# Altium project Mjollnir.PrjPcb (part 2 of 2)
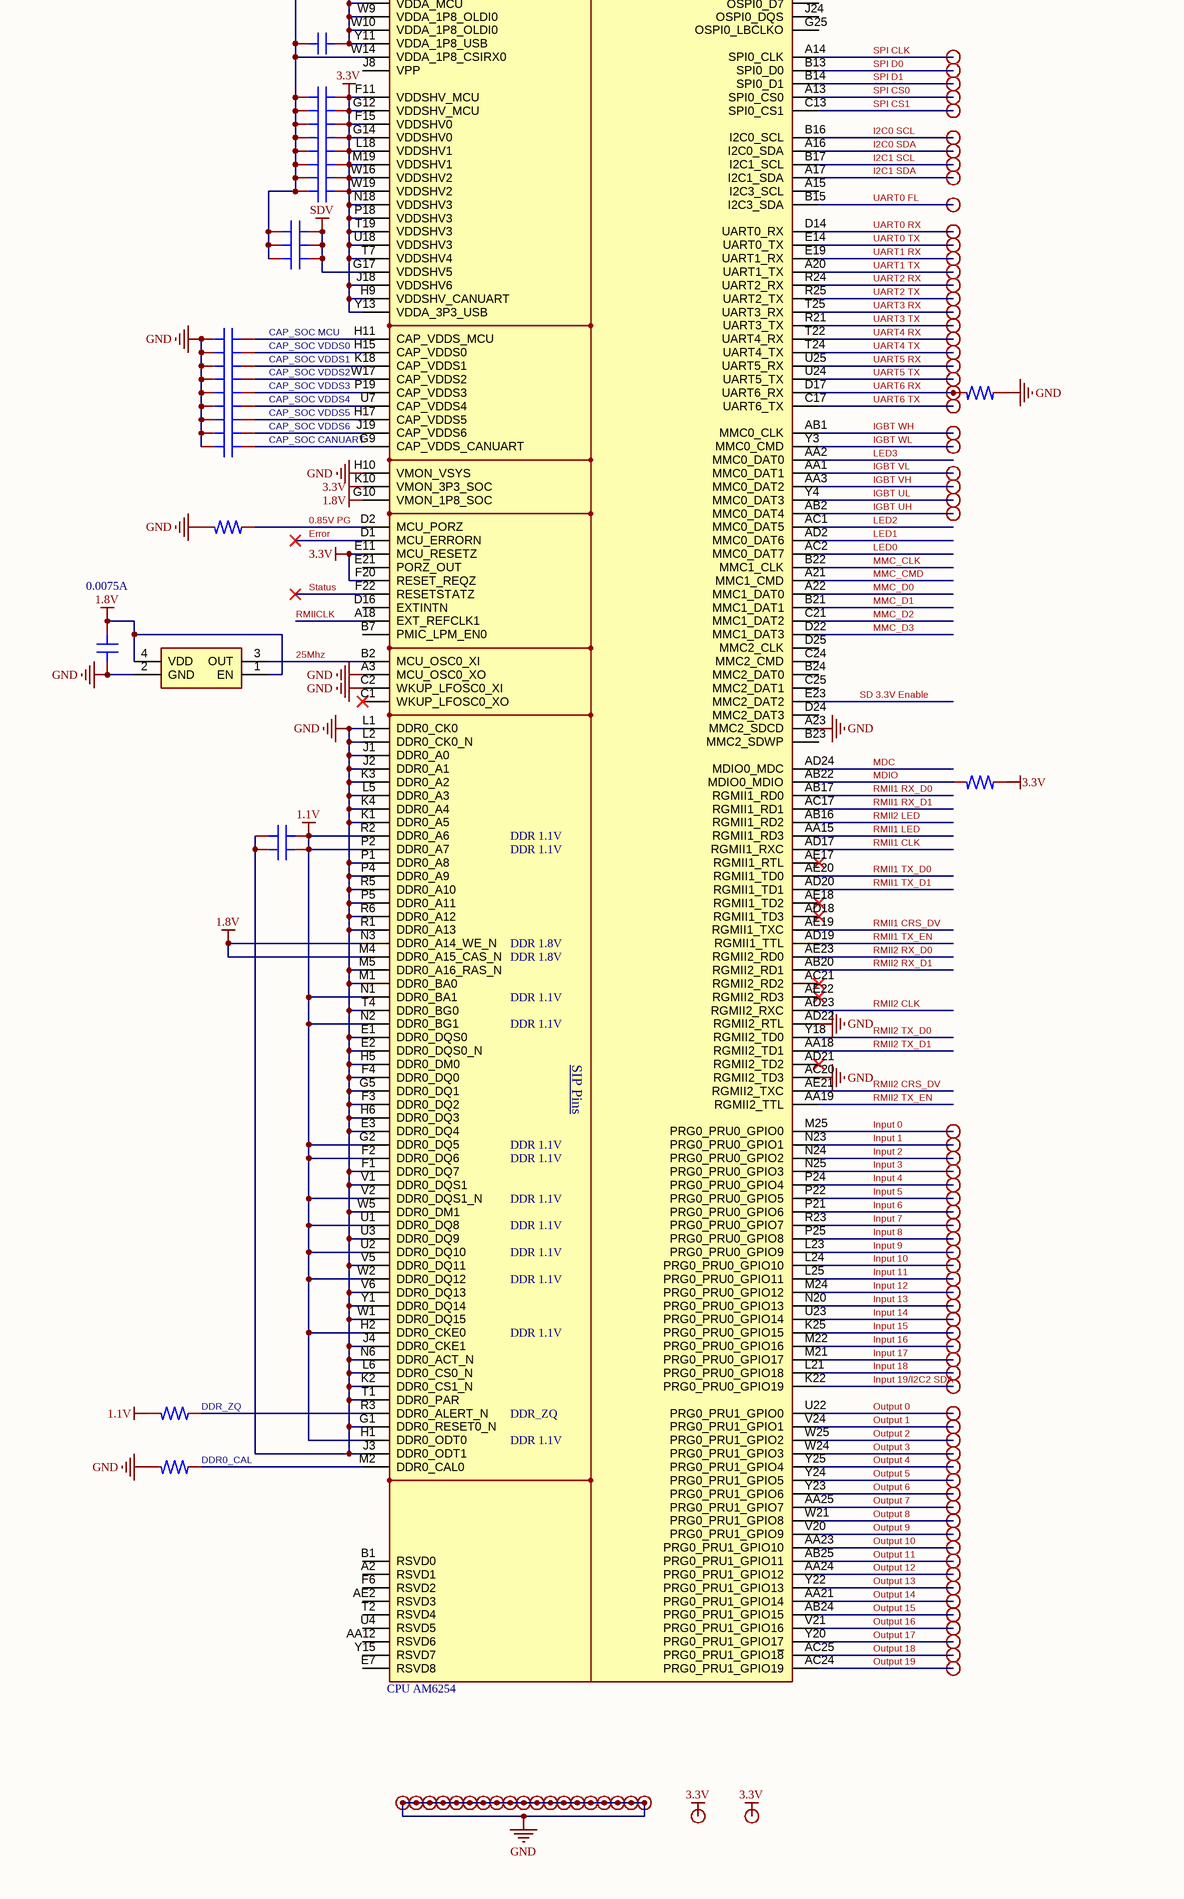
[diagram p3: Mjollnir.SchDoc, bottom left]

## Sheet Mjollnir.SchDoc (continued)

### Library data of the parts
BUCK_0.85V BUCK_1.1V BUCK_1.8V BUCK_3.3V = Buck TLV62585PDLR: Buck 3A 1500Mhz; Manufacturer_Name: Texas Instruments; Manufacturer_Part_Number: XTPS566247DRLR; Price: Rs. 24
C_1.8V_Crystal C_AM62x_0.85V-1-C_AM62x_0.85V-14 C_AM62x_1.1V-1-C_AM62x_1.1V-7 C_AM62x_1.8V-1-C_AM62x_1.8V-5 C_AM62x_1.8V-10 C_AM62x_3.3V-1-C_AM62x_3.3V-8 C_AM62x_SDV_0.1uF C_AM62x_SDV_1uF C_AM62x_SDV_10uF C_Backup-1-C_Backup-12 C_BUCK-0.85V-IN C_BUCK-0.85V-OUT1 C_BUCK-0.85V-OUT2 C_BUCK-1.1V-IN C_BUCK-1.1V-OUT1 C_BUCK-1.1V-OUT2 C_BUCK-1.8V-IN C_BUCK-1.8V-OUT1 C_BUCK-1.8V-OUT2 C_BUCK-3.3V-IN C_BUCK-3.3V-OUT1 C_BUCK-3.3V-OUT2 C_CAP_SOC_MCU C_CAP_SOC_VDDS0-C_CAP_SOC_VDDS6 C_CAP_SOC_VDDS_CANUART C_EthernetPHY1-1 C_EthernetPHY2-1 C_EthernetPHY_Earth C_LDO_SDV-IN C_MMC-1 C_RJ451_RD1 C_RJ451_TD1 C_RJ452_RD1 C_RJ452_TD1 = Capacitor
Connector_3.3V_Aux-1 Connector_3.3V_Aux-2 Connector_5V-1-Connector_5V-4 Connector_GND1-Connector_GND9 Connector_GND11-Connector_GND20 Connector_I2C0_SCL Connector_I2C0_SDA Connector_I2C1_SCL Connector_I2C1_SDA Connector_I2C2_SDA Connector_IGBT_UH Connector_IGBT_UL Connector_IGBT_VH Connector_IGBT_VL Connector_IGBT_WH Connector_IGBT_WL Connector_JTAG_5V Connector_JTAG_GND-1 Connector_JTAG_GND-2 Connector_JTAG_RST Connector_JTAG_TCK Connector_JTAG_TDI Connector_JTAG_TDO Connector_JTAG_TMS Connector_JTAG_TX Connector_JTAG_UART_RX Connector_MCAN_RX Connector_MCAN_TX Connector_MCU_I2C_SCL Connector_MCU_I2C_SDA Connector_MCU_MCAN0_RX Connector_MCU_MCAN0_TX Connector_MCU_MCAN1_RX Connector_MCU_MCAN1_TX Connector_MCU_RESETSTATZ Connector_MCU_SPI_CLK Connector_MCU_SPI_CS0 Connector_MCU_SPI_CS1 Connector_MCU_SPI_D0 Connector_MCU_SPI_D1 Connector_MCU_UART_CTS Connector_MCU_UART_RTS Connector_MCU_UART_RX Connector_MCU_UART_TX Connector_PRU0_GPIO0-Connector_PRU0_GPIO19 Connector_PRU1_GPIO0-Connector_PRU1_GPIO19 Connector_R5F_CLOCKOUT Connector_R5F_I2C_SCL Connector_R5F_I2C_SDA Connector_R5F_UART_CTS Connector_R5F_UART_RTS Connector_R5F_UART_RX Connector_R5F_UART_TX Connector_SPI_CS0 Connector_SPI_CS1 Connector_SPI_D0 Connector_SPI_D1 Connector_SPL_CLK Connector_UART0_FL Connector_UART0_RX Connector_UART0_TX Connector_UART1_FL Connector_UART1_RX Connector_UART1_TX Connector_UART2_RX Connector_UART2_TX Connector_UART3_RX Connector_UART3_TX Connector_UART4_RX Connector_UART4_TX Connector_UART5_RX Connector_UART5_TX Connector_UART6_RX Connector_UART6_TX = Connector BergStrip: BergStrip
Connector_MicroSD = Connector MicroSD SameSky MSD-11-A: MicroSD Slot; Link: https://roboticsdna.in/product/micro-sd-card-socket-adapter-self-pop-up-memory-card-slot-holder-2-pcs/; Price: Rs. 11
Connector_RJ451 Connector_RJ452 = Connector HR911105A: RJ45 With Magnetics 10/100Mbps
Connector_USB = Connector USB-A 2 Row: Manufacturer_Name: Wurth Elektronik; Manufacturer_Part_Number: 61400826021; Datasheet Link: https://katalog.we-online.com/em/datasheet/61400826021.pdf; Mouser Part Number: 710-61400826021; Mouser Price/Stock: https://www.mouser.co.uk/ProductDetail/Wurth-Elektronik/61400826021?qs=rS3zZhy2AQNRjP3Vs%2FPxTg%3D%3D
CPU = CPU AM6254: Quad Core A53; Price: Rs. 3113
EthernetPHY2 EthernetPHY_1 = EthernetPHY DP83825IR: PHY 10/100 Mbps; Manufacturer_Name: Texas Instruments; Copyright: Copyright (C) 2025 Ultra Librarian. All rights reserved.; Manufacturer_Part_Number: DP83825IRMQR; Datasheet: https://www.ti.com/lit/gpn/dp83825i; RefDes: RefDes; Type: Type
L_Buck_0.85V L_Buck_1.1V L_Buck_1.8V L_Buck_3.3V = Inductor: https://robu.in/product/tfm201610alm-1r0mtaa-tdk-3-1a-1uh-%c2%b120-4-3a-50m%cf%89-smd1-6x2mm-inductors-smd-rohs/
LDO_1.8V-SD LDO_3.3V-SD = LDO TLV743xxPDBV: LDO 300mA; Manufacturer_Name: Texas Instruments; Manufacturer_Part_Number: TLV743xxPDBV; Datasheet: https://www.ti.com/lit/gpn/tlv755p; Price: Rs. 9
LED0-LED3 LED_3.3V LED_5V LED_IGBT_UH LED_IGBT_UL LED_IGBT_VH LED_IGBT_VL LED_IGBT_WH LED_IGBT_WL = LED
MDIO_Pullup MMC_SDCD_Pulldown R_BootStrap_Down_3-R_BootStrap_Down_15 R_BootStrap_Up_0-R_BootStrap_Up_9 R_BUCK-0.85V_Divider-H R_BUCK-0.85V_Divider-L R_BUCK-0.85V_PG R_BUCK-1.1V_Divider-H R_BUCK-1.1V_Divider-L R_BUCK-1.1V_PG R_BUCK-1.8V_Divider-H R_BUCK-1.8V_Divider-L R_BUCK-1.8V_PG R_BUCK-3.3V_Divider-H R_BUCK-3.3V_Divider-L R_BUCK-3.3V_EN R_BUCK-3.3V_PG R_DDR0_CAL0 R_DDRZQ R_EthernetPHY1_LED_Act R_EthernetPHY1_LED_USER R_EthernetPHY2_LED_Act R_EthernetPHY2_LED_USER R_EthernetPHY_Earth R_JTAG_Pulldown_RST R_JTAG_TDO R_LDO-1.8V-SD_Pulldown R_LDO-3.3V-SD_Pullup R_LED0-R_LED3 R_LED_3.3V R_LED_5V R_LED_IGBT_UH R_LED_IGBT_UL R_LED_IGBT_VH R_LED_IGBT_VL R_LED_IGBT_WH R_LED_IGBT_WL R_MCU_PORZ R_MMC_PULLUP_CMD R_MMC_PULLUP_D0-R_MMC_PULLUP_D3 R_RBIAS_EthernetPHY1 R_RBIAS_EthernetPHY2 R_USB0_CAL R_USB1_CAL RMII2_Strap_Address_1 = Resistor
X_25Mz_AM62x = Crystal CMOS: Crystal Oscilator CMOS Output; Manufacturer_Name: ECS; Manufacturer_Part_Number: ECS-2520MV-250-CN-TR; Geometry.Height: 0.9mm; Mouser Part Number: 520-2520MV-250-CN-T; Mouser Price/Stock: https://www.mouser.co.uk/ProductDetail/ECS/ECS-2520MV-250-CN-TR?qs=fAHHVMwC%252BbiTva9uv8VI%2Fw%3D%3D; Datasheet Link: https://www.arrow.com/en/products/ecs-2520mv-250-cn-tr/ecs-international